# Altium project B905AA.PrjPcb (part 2 of 2)

## Sheet RS485 Under Leaf Sensor Socket.SchDoc: RS485 Under Leaf Sensor Socket
size 292 x 193 mm; SheetNumber: 18; SheetTotal: 21
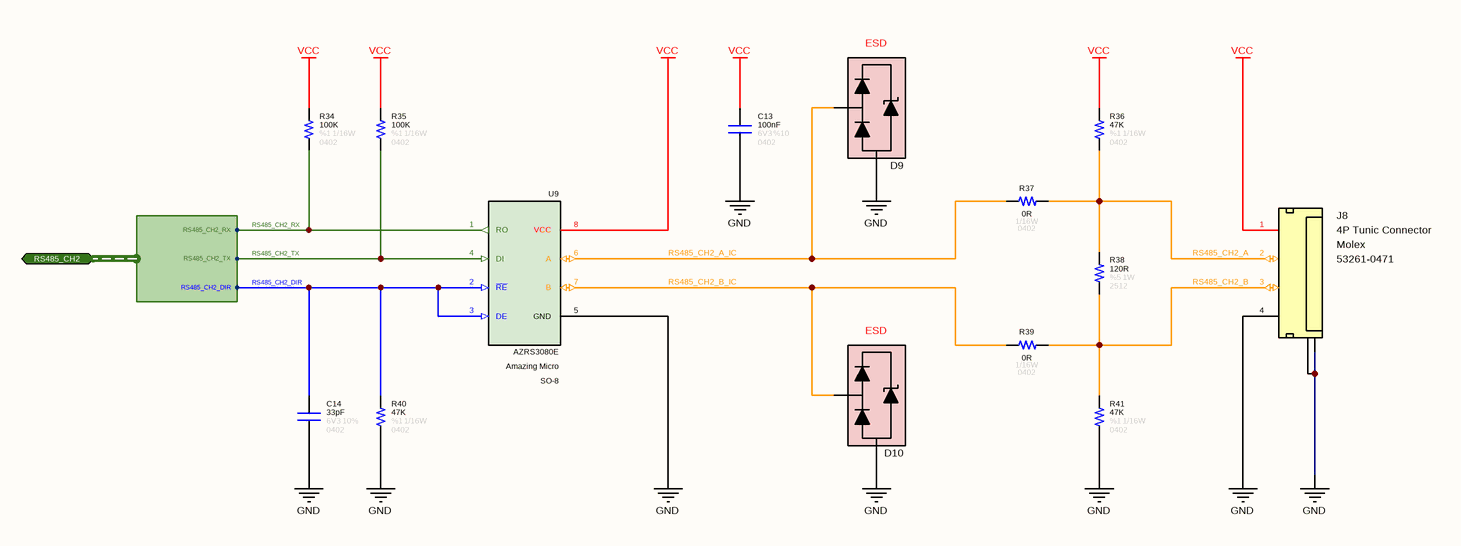
[diagram p15: RS485 Under Leaf Sensor Socket.SchDoc]

### Parts
C13  value 100nF  Tolerance: %10  Voltage: 6V3  Case: 0402  [CAPACITOR_0402]  (hidden comment: Capacitor - 100nF [0402] (Ceramic))
C14  value 33pF  Tolerance: 10%  Case: 0402  Voltage: 6V3  [CAPACITOR_0402]  (hidden comment: Capacitor - 33pF [0402] (Ceramic))
D9  0402ESDA-MLP1  [ESD_0402]  (value not drawn)
D10  0402ESDA-MLP1  [ESD_0402]  (value not drawn)
J8  Manufacturer Name: Molex  Manufacturer Part Number: 53261-0471  [Connector_Tunic 4P]  (hidden comment: 4P SMD Tunic Connector)
R34  value 100K  Tolerance: %1  Case: 0402  Power: 1/16W  [RESISTOR_0402]  (hidden comment: 100K - 0402 - %1 - 1/16W)
R35  value 100K  Tolerance: %1  Case: 0402  Power: 1/16W  [RESISTOR_0402]  (hidden comment: 100K - 0402 - %1 - 1/16W)
R36  value 47K  Tolerance: %1  Case: 0402  Power: 1/16W  [RESISTOR_0402]  (hidden comment: 47K - 0402 - %1 - 1/16W)
R37  value 0R  Case: 0402  Power: 1/16W  [RESISTOR_0402]  (hidden comment: 0R - 0402 - %1 - 1/16W)
R38  value 120R  Tolerance: %5  Case: 2512  Power: 1W  [RESISTOR_2512]  (hidden comment: 120R - 2512 - %5 - 1W)
R39  value 0R  Case: 0402  Power: 1/16W  [RESISTOR_0402]  (hidden comment: 0R - 0402 - %1 - 1/16W)
R40  value 47K  Tolerance: %1  Case: 0402  Power: 1/16W  [RESISTOR_0402]  (hidden comment: 47K - 0402 - %1 - 1/16W)
R41  value 47K  Tolerance: %1  Case: 0402  Power: 1/16W  [RESISTOR_0402]  (hidden comment: 47K - 0402 - %1 - 1/16W)
U9  Case: SO-8  Manufacturer Part Number: AZRS3080E  Manufacturer Name: Amazing Micro  [SOP-8L (AZRS3080E)]  (hidden comment: RS485 Modulator)

### Ports
RS485_CH2 (bidir, harness RS485_CH2)

### Harnesses
RS485_CH2: RS485_CH2_RX, RS485_CH2_TX, RS485_CH2_DIR

### Nets
GND: C13.1 C14.1 D9.2(GND) D10.2(GND) J8.4(Pin-4) J8.5(GND) J8.6(GND) R40.1 R41.1 U9.5(GND)
VCC: C13.2 J8.1(Pin-1) R34.2 R35.2 R36.2 U9.8(VCC)
RS485_CH2_A: J8.2(Pin-2) R36.1 R37.1 R38.2
RS485_CH2_A_IC: D9.1(I/O) R37.2 U9.6(A)
RS485_CH2_B: J8.3(Pin-3) R38.1 R39.1 R41.2
RS485_CH2_B_IC: D10.1(I/O) R39.2 U9.7(B)
RS485_CH2_DIR: C14.2 R40.2 U9.2(~{RE}) U9.3(DE) ; port RS485_CH2.RS485_CH2_DIR
RS485_CH2_RX: R34.1 U9.1(RO) ; port RS485_CH2.RS485_CH2_RX
RS485_CH2_TX: R35.1 U9.4(DI) ; port RS485_CH2.RS485_CH2_TX

### Notes on the sheet
- © 2021 All rights reserved.
  This document may not, in whole or in part, be copied, photocopied, reproduced, translated or converted to any electronic or machine readable from without prior written permission of Mehmet Günce Akkoyun.
  Engineer contact : akkoyun@me.com
- Property of
- Engineer :
- Date :
- Size :
- A4
- Time :
- Project :
- Page :
- /
- Customer :
- Product ID :
- Module ID :
- Version :
- File :
- Revision :
- (in symbol Connector - Mini Tunic 4P (1.25)) 4P Tunic Connector
- (in symbol Diode - TPD1E05U06DPYR) ESD

### Library data of the parts
C13 = Capacitor - 100nF [0402-6V3]: Capacitor - 100nF [0402-6V3] (Ceramic); Manufacturer Name: AVX; Manufacturer Part Number: 04026D104KAT4A; ComponentLink1Description: Mouser; ComponentLink1URL: https://www.mouser.com.tr/ProductDetail/AVX/04026D104KAT4A?qs=sGAEpiMZZMs0AnBnWHyRQPg4iYkCw7IMED%2F4kpqgf7w%3D; ComponentLink2Description: DataSheet; ComponentLink2URL: https://www.mouser.com.tr/datasheet/2/40/cx5r-776519.pdf
C14 = Capacitor - 33pF [0402-6V3]: Manufacturer Name: Kemet; Manufacturer Part Number: C0402C330J9RACAUTO; ComponentLink1Description: DataSheet; ComponentLink1URL: https://api.kemet.com/component-edge/download/datasheet/C0402C330J9RACAUTO.pdf; ComponentLink2Description: Mouser; ComponentLink2URL: https://www.mouser.com/Search/Refine.aspx?Keyword=80-C0402C330J9RAUTO
D9 D10 = Diode - TPD1E05U06DPYR: SUPPRESSOR ESD 30VDC 0402 HFREE; Manufacturer Name: Eaton; Breakdown Voltage: 30V; Capacitance: 0.15pF; Manufacturer Part Number: 0402ESDA-MLP1; Case: 0402
J8 = Connector - Mini Tunic 4P (1.25): Mini Tunic Connector with 4P; Pitch: 1.25mm; Position: 4; ROHS: Yes; ComponentLink1Description: DataSheet; ComponentLink1URL: https://www.mouser.com.tr/datasheet/2/276/0532610471_PCB_HEADERS-170942.pdf; ComponentLink2Description: Mouser; ComponentLink2URL: https://www.mouser.com.tr/ProductDetail/Molex/53261-0471?qs=%2Fha2pyFaduhLhIsk8tywtK7BwWtguBSP4XxyDBTOTfs%3D; Case: SMD
R34 R35 = Resistor - 100K [0402]: Thick Film Resistors - SMD 1/16 W 100 KOhm 1%; Manufacturer Name: Vishay; Manufacturer Part Number: CRCW0402100KFKED; ComponentLink1Description: DataSheet; ComponentLink1URL: https://www.mouser.com.tr/datasheet/2/427/dcrcwe3-1762152.pdf; ComponentLink2Description: Mouser; ComponentLink2URL: https://www.mouser.com.tr/ProductDetail/Vishay-Dale/CRCW040210K0FKED?qs=sGAEpiMZZMu61qfTUdNhG2DpbjADlD3GcalbOv9utCY%3D
R36 R40 R41 = Resistor - 47K [0402]: Thick Film Resistors - SMD 1/16 W 47 KOhm 1%; Manufacturer Name: Vishay; Manufacturer Part Number: CRCW040247K0FKED; ComponentLink1Description: DataSheet; ComponentLink1URL: https://www.mouser.com.tr/datasheet/2/427/dcrcwe3-1762152.pdf; ComponentLink2Description: Mouser; ComponentLink2URL: https://www.mouser.com.tr/ProductDetail/Vishay-Dale/CRCW040247K0FKED?qs=sGAEpiMZZMu61qfTUdNhG2DpbjADlD3GL%252B3h1elTxqU%3D
R37 R39 = Resistor - 0R [0402]: Thick Film Resistors - SMD 1/16 W 0 Ohm; Manufacturer Name: Vishay; Manufacturer Part Number: CRCW04020000Z0ED; ComponentLink1Description: DataSheet; ComponentLink1URL: https://www.mouser.com.tr/datasheet/2/427/dcrcwe3-1762152.pdf; ComponentLink2Description: Mouser; ComponentLink2URL: https://www.mouser.com.tr/ProductDetail/Vishay-Dale/CRCW04020000Z0ED?qs=sGAEpiMZZMu61qfTUdNhG2DpbjADlD3GG34cJb50zyg%3D
R38 = Resistor - 120R [2512]: Thick Film Resistors - SMD 1 W 120 Ohm 5%; Manufacturer Name: YAGEO; Manufacturer Part Number: RC2512JK-07120RL; ComponentLink1Description: DataSheet; ComponentLink1URL: https://www.mouser.com.tr/datasheet/2/447/PYu_RC_Group_51_RoHS_L_11-1984063.pdf
U9 = IC - AZRS3080E: Half-duplex RS485 transceiver.; RoHS: Yes; ComponentLink1Description: DataSheet; ComponentLink1URL: https://www.amazingic.com/common/frontend/download?path=/uploads/images/products/PDF/AZRS/AZRS3080E.pdf

## Sheet RS485 Reserved Sensor Socket.SchDoc: RS485 Reserved Sensor Socket
size 292 x 193 mm; SheetNumber: 19; SheetTotal: 21
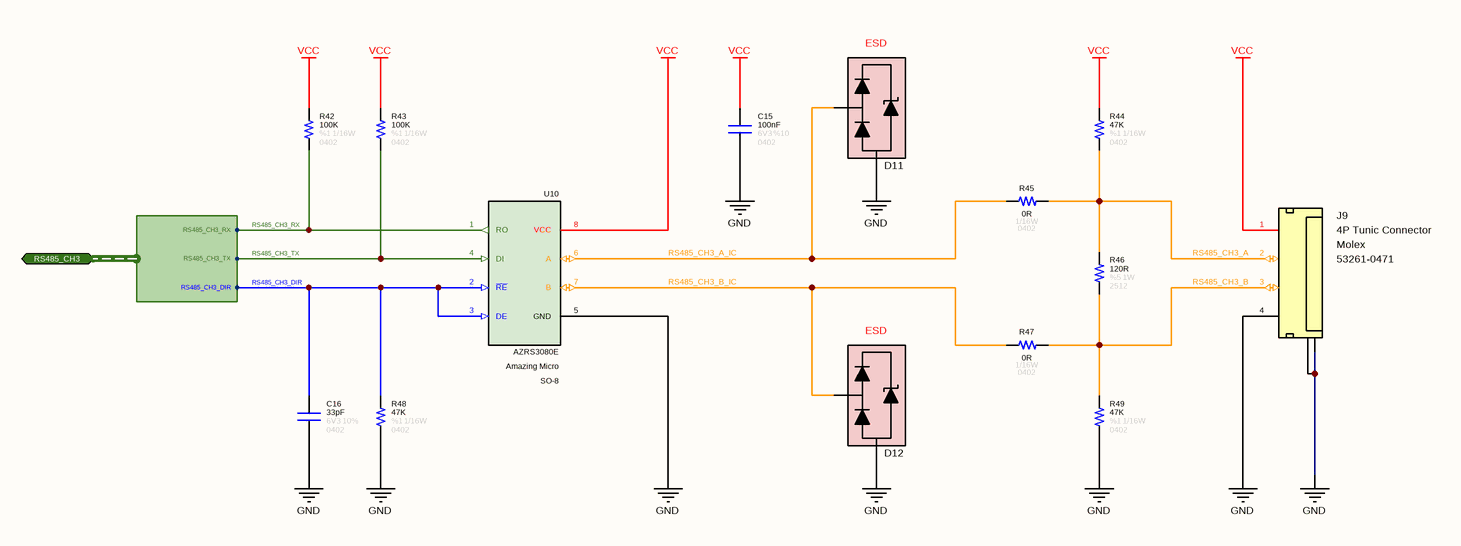
[diagram p16: RS485 Reserved Sensor Socket.SchDoc]

### Parts
C15  value 100nF  Tolerance: %10  Voltage: 6V3  Case: 0402  [CAPACITOR_0402]  (hidden comment: Capacitor - 100nF [0402] (Ceramic))
C16  value 33pF  Tolerance: 10%  Case: 0402  Voltage: 6V3  [CAPACITOR_0402]  (hidden comment: Capacitor - 33pF [0402] (Ceramic))
D11  0402ESDA-MLP1  [ESD_0402]  (value not drawn)
D12  0402ESDA-MLP1  [ESD_0402]  (value not drawn)
J9  Manufacturer Name: Molex  Manufacturer Part Number: 53261-0471  [Connector_Tunic 4P]  (hidden comment: 4P SMD Tunic Connector)
R42  value 100K  Tolerance: %1  Case: 0402  Power: 1/16W  [RESISTOR_0402]  (hidden comment: 100K - 0402 - %1 - 1/16W)
R43  value 100K  Tolerance: %1  Case: 0402  Power: 1/16W  [RESISTOR_0402]  (hidden comment: 100K - 0402 - %1 - 1/16W)
R44  value 47K  Tolerance: %1  Case: 0402  Power: 1/16W  [RESISTOR_0402]  (hidden comment: 47K - 0402 - %1 - 1/16W)
R45  value 0R  Case: 0402  Power: 1/16W  [RESISTOR_0402]  (hidden comment: 0R - 0402 - %1 - 1/16W)
R46  value 120R  Tolerance: %5  Case: 2512  Power: 1W  [RESISTOR_2512]  (hidden comment: 120R - 2512 - %5 - 1W)
R47  value 0R  Case: 0402  Power: 1/16W  [RESISTOR_0402]  (hidden comment: 0R - 0402 - %1 - 1/16W)
R48  value 47K  Tolerance: %1  Case: 0402  Power: 1/16W  [RESISTOR_0402]  (hidden comment: 47K - 0402 - %1 - 1/16W)
R49  value 47K  Tolerance: %1  Case: 0402  Power: 1/16W  [RESISTOR_0402]  (hidden comment: 47K - 0402 - %1 - 1/16W)
U10  Case: SO-8  Manufacturer Part Number: AZRS3080E  Manufacturer Name: Amazing Micro  [SOP-8L (AZRS3080E)]  (hidden comment: RS485 Modulator)

### Ports
RS485_CH3 (bidir, harness RS485_CH3)

### Harnesses
RS485_CH3: RS485_CH3_RX, RS485_CH3_TX, RS485_CH3_DIR

### Nets
GND: C15.1 C16.1 D11.2(GND) D12.2(GND) J9.4(Pin-4) J9.5(GND) J9.6(GND) R48.1 R49.1 U10.5(GND)
VCC: C15.2 J9.1(Pin-1) R42.2 R43.2 R44.2 U10.8(VCC)
RS485_CH3_A: J9.2(Pin-2) R44.1 R45.1 R46.2
RS485_CH3_A_IC: D11.1(I/O) R45.2 U10.6(A)
RS485_CH3_B: J9.3(Pin-3) R46.1 R47.1 R49.2
RS485_CH3_B_IC: D12.1(I/O) R47.2 U10.7(B)
RS485_CH3_DIR: C16.2 R48.2 U10.2(~{RE}) U10.3(DE) ; port RS485_CH3.RS485_CH3_DIR
RS485_CH3_RX: R42.1 U10.1(RO) ; port RS485_CH3.RS485_CH3_RX
RS485_CH3_TX: R43.1 U10.4(DI) ; port RS485_CH3.RS485_CH3_TX

### Notes on the sheet
- © 2021 All rights reserved.
  This document may not, in whole or in part, be copied, photocopied, reproduced, translated or converted to any electronic or machine readable from without prior written permission of Mehmet Günce Akkoyun.
  Engineer contact : akkoyun@me.com
- Property of
- Engineer :
- Date :
- Size :
- A4
- Time :
- Project :
- Page :
- /
- Customer :
- Product ID :
- Module ID :
- Version :
- File :
- Revision :
- (in symbol Connector - Mini Tunic 4P (1.25)) 4P Tunic Connector
- (in symbol Diode - TPD1E05U06DPYR) ESD

### Library data of the parts
C15 = Capacitor - 100nF [0402-6V3]: as C13 on sheet RS485 Under Leaf Sensor Socket; ComponentLink1Description: Mouser; ComponentLink1URL: https://www.mouser.com.tr/ProductDetail/AVX/04026D104KAT4A?qs=sGAEpiMZZMs0AnBnWHyRQPg4iYkCw7IMED%2F4kpqgf7w%3D; ComponentLink2Description: DataSheet; ComponentLink2URL: https://www.mouser.com.tr/datasheet/2/40/cx5r-776519.pdf
C16 = Capacitor - 33pF [0402-6V3]: as C14 on sheet RS485 Under Leaf Sensor Socket; ComponentLink1Description: DataSheet; ComponentLink1URL: https://api.kemet.com/component-edge/download/datasheet/C0402C330J9RACAUTO.pdf; ComponentLink2Description: Mouser; ComponentLink2URL: https://www.mouser.com/Search/Refine.aspx?Keyword=80-C0402C330J9RAUTO
D11 D12 = Diode - TPD1E05U06DPYR: as D9 on sheet RS485 Under Leaf Sensor Socket; Manufacturer Part Number: 0402ESDA-MLP1; Case: 0402
J9 = Connector - Mini Tunic 4P (1.25): as J8 on sheet RS485 Under Leaf Sensor Socket; ROHS: Yes; ComponentLink1Description: DataSheet; ComponentLink1URL: https://www.mouser.com.tr/datasheet/2/276/0532610471_PCB_HEADERS-170942.pdf; ComponentLink2Description: Mouser; ComponentLink2URL: https://www.mouser.com.tr/ProductDetail/Molex/53261-0471?qs=%2Fha2pyFaduhLhIsk8tywtK7BwWtguBSP4XxyDBTOTfs%3D; Case: SMD
R42 R43 = Resistor - 100K [0402]: as R34 on sheet RS485 Under Leaf Sensor Socket; ComponentLink1Description: DataSheet; ComponentLink1URL: https://www.mouser.com.tr/datasheet/2/427/dcrcwe3-1762152.pdf; ComponentLink2Description: Mouser; ComponentLink2URL: https://www.mouser.com.tr/ProductDetail/Vishay-Dale/CRCW040210K0FKED?qs=sGAEpiMZZMu61qfTUdNhG2DpbjADlD3GcalbOv9utCY%3D
R44 R48 R49 = Resistor - 47K [0402]: as R36 on sheet RS485 Under Leaf Sensor Socket; ComponentLink1Description: DataSheet; ComponentLink1URL: https://www.mouser.com.tr/datasheet/2/427/dcrcwe3-1762152.pdf; ComponentLink2Description: Mouser; ComponentLink2URL: https://www.mouser.com.tr/ProductDetail/Vishay-Dale/CRCW040247K0FKED?qs=sGAEpiMZZMu61qfTUdNhG2DpbjADlD3GL%252B3h1elTxqU%3D
R45 R47 = Resistor - 0R [0402]: as R37 on sheet RS485 Under Leaf Sensor Socket; ComponentLink1Description: DataSheet; ComponentLink1URL: https://www.mouser.com.tr/datasheet/2/427/dcrcwe3-1762152.pdf; ComponentLink2Description: Mouser; ComponentLink2URL: https://www.mouser.com.tr/ProductDetail/Vishay-Dale/CRCW04020000Z0ED?qs=sGAEpiMZZMu61qfTUdNhG2DpbjADlD3GG34cJb50zyg%3D
R46 = Resistor - 120R [2512]: as R38 on sheet RS485 Under Leaf Sensor Socket; ComponentLink1Description: DataSheet; ComponentLink1URL: https://www.mouser.com.tr/datasheet/2/447/PYu_RC_Group_51_RoHS_L_11-1984063.pdf
U10 = IC - AZRS3080E: Half-duplex RS485 transceiver.; RoHS: Yes; ComponentLink1Description: DataSheet; ComponentLink1URL: https://www.amazingic.com/common/frontend/download?path=/uploads/images/products/PDF/AZRS/AZRS3080E.pdf

## Sheet B802 PCIe Socket.SchDoc: B802AA PCIe Socket
size 292 x 193 mm; SheetNumber: 18; SheetTotal: 18
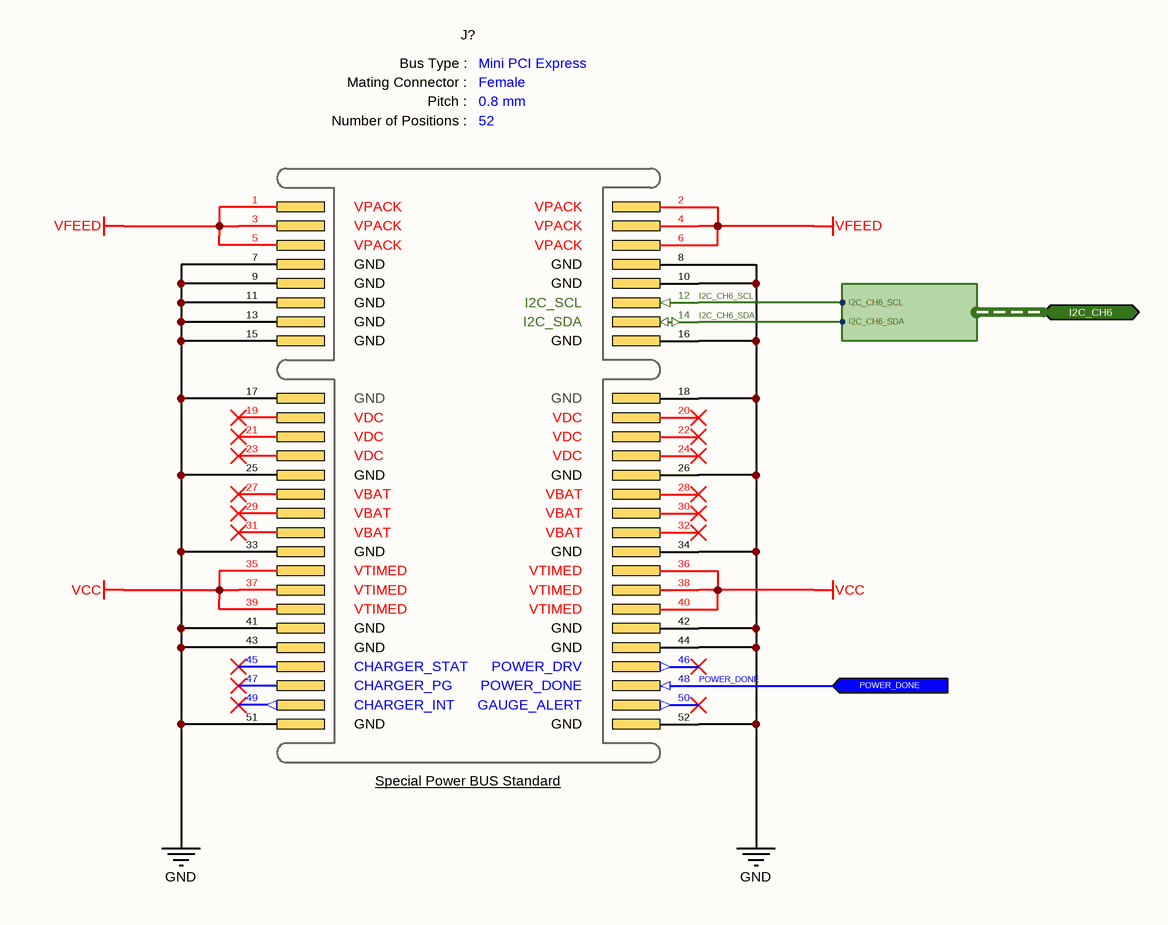
[diagram p17: B802 PCIe Socket.SchDoc]

### Parts
J?  BUS Type: Mini PCI Express  Connector Type: Female  Pitch: 0.8 mm  Number of Positions: 52  [CONNECTOR - Mini PCIe (Light)]  (hidden comment: TE-1775862-2)

### Ports
I2C_CH6 (bidir, harness I2C_CH6), POWER_DONE (in)

### Harnesses
I2C_CH6: I2C_CH6_SCL, I2C_CH6_SDA

### Nets
GND: J?.7(Pin-7) J?.8(Pin-8) J?.9(Pin-9) J?.10(Pin-10) J?.11(Pin-11) J?.13(Pin-13) J?.15(Pin-15) J?.16(Pin-16) J?.17(Pin-17) J?.18(Pin-18) J?.25(Pin-25) J?.26(Pin-26) J?.33(Pin-33) J?.34(Pin-34) J?.41(Pin-41) J?.42(Pin-42) J?.43(Pin-43) J?.44(Pin-44) J?.51(Pin-51) J?.52(Pin-52)
VCC: J?.35(Pin-35) J?.36(Pin-36) J?.37(Pin-37) J?.38(Pin-38) J?.39(Pin-39) J?.40(Pin-40)
VFEED: J?.1(Pin-1) J?.2(Pin-2) J?.3(Pin-3) J?.4(Pin-4) J?.5(Pin-5) J?.6(Pin-6)
I2C_CH6_SCL: J?.12(Pin-12) ; port I2C_CH6.I2C_CH6_SCL
I2C_CH6_SDA: J?.14(Pin-14) ; port I2C_CH6.I2C_CH6_SDA
POWER_DONE: J?.48(Pin-48) ; port POWER_DONE

Not connected (* = marked no-connect by the designer): J? 19(Pin-19)* 20(Pin-20)* 21(Pin-21)* 22(Pin-22)* 23(Pin-23)* 24(Pin-24)* 27(Pin-27)* 28(Pin-28)* 29(Pin-29)* 30(Pin-30)* 31(Pin-31)* 32(Pin-32)* 45(Pin-45)* 46(Pin-46)* 47(Pin-47)* 49(Pin-49)* 50(Pin-50)*

### Notes on the sheet
- © 2021 All rights reserved.
  This document may not, in whole or in part, be copied, photocopied, reproduced, translated or converted to any electronic or machine readable from without prior written permission of Mehmet Günce Akkoyun.
  Engineer contact : akkoyun@me.com
- Property of
- Engineer :
- Date :
- Size :
- A4
- Time :
- Project :
- Page :
- /
- Customer :
- Product ID :
- Module ID :
- Version :
- File :
- Revision :
- (in symbol Connector - Mini PCI-E (Female B802)) Bus Type :; Mating Connector :; Pitch :; Number of Positions :; VPACK; GND; I2C_SCL; I2C_SDA; VDC; VBAT; VTIMED; CHARGER_STAT; POWER_DRV; CHARGER_PG; POWER_DONE; CHARGER_INT; GAUGE_ALERT; Special Power BUS Standard

### Library data of the parts
J? = Connector - Mini PCI-E (Female B802): Mini PCI-Express female connector.; Manufacturer Name: TE Connectivity; Manufacturer Part Number: TE-1775862-2; System: Connector

## Nets that join several sheets
GND: B001 PCIe Socket (J1.15 J1.16 J1.45 J1.51), B101 PCIe Socket (12 pins), I2C Multiplexer (6 pins), I2C DP Sensor 1 (C3.1 U2.3), I2C DP Sensor 2 (C4.1 U3.3), I2C DP Sensor 3 (C5.1 U4.3), I2C TH Sensor Socket (5 pins), I2C UV Sensor (C32.1 U15.8), I2C P Sensor (C6.1 C7.1 U5.3), RS485 Multiplexer (C8.1 U6.7 U6.8), RS485 Rain Sensor Socket (10 pins), RS485 Soil Temperature Sensor Socket (10 pins), RS485 Under Leaf Sensor Socket (10 pins), RS485 Reserved Sensor Socket (10 pins), B802 PCIe Socket (20 pins)
VCC: B001 PCIe Socket (9 pins), I2C Multiplexer (6 pins), I2C DP Sensor 1 (C3.2 R6.2 R7.2 U2.2), I2C DP Sensor 2 (C4.2 R8.2 R9.2 U3.2), I2C DP Sensor 3 (C5.2 R10.2 R11.2 U4.2), I2C TH Sensor Socket (J4.1 R14.2 R15.2), I2C UV Sensor (6 pins), I2C P Sensor (5 pins), RS485 Multiplexer (C8.2 U6.16), RS485 Rain Sensor Socket (6 pins), RS485 Soil Temperature Sensor Socket (6 pins), RS485 Under Leaf Sensor Socket (6 pins), RS485 Reserved Sensor Socket (6 pins), B802 PCIe Socket (6 pins)
VFEED: B101 PCIe Socket (6 pins), B802 PCIe Socket (6 pins)
GNSS_EN: B001 PCIe Socket (J1.30), B101 PCIe Socket (J2.36)
GSM_COMMEN: B001 PCIe Socket (J1.52), B101 PCIe Socket (J2.14)
GSM_ON/OFF: B001 PCIe Socket (J1.42), B101 PCIe Socket (J2.32)
GSM_PWR_EN: B001 PCIe Socket (J1.32), B101 PCIe Socket (J2.12)
GSM_PWRMON: B001 PCIe Socket (J1.46), B101 PCIe Socket (J2.26)
GSM_RING: B001 PCIe Socket (J1.50), B101 PCIe Socket (J2.30)
GSM_RX: B001 PCIe Socket (J1.40), B101 PCIe Socket (J2.20)
GSM_SDOWN: B001 PCIe Socket (J1.44), B101 PCIe Socket (J2.34)
GSM_SWREADY: B001 PCIe Socket (J1.48), B101 PCIe Socket (J2.28)
GSM_TX: B001 PCIe Socket (J1.38), B101 PCIe Socket (J2.22)
I2C_CH0_SCL: I2C Multiplexer (U1.5), I2C DP Sensor 1 (R6.1 U2.1)
I2C_CH0_SDA: I2C Multiplexer (U1.4), I2C DP Sensor 1 (R7.1 U2.4)
I2C_CH1_SCL: I2C Multiplexer (U1.7), I2C DP Sensor 2 (R8.1 U3.1)
I2C_CH1_SDA: I2C Multiplexer (U1.6), I2C DP Sensor 2 (R9.1 U3.4)
I2C_CH2_SCL: I2C Multiplexer (U1.9), I2C DP Sensor 3 (R10.1 U4.1)
I2C_CH2_SDA: I2C Multiplexer (U1.8), I2C DP Sensor 3 (R11.1 U4.4)
I2C_CH3_SCL: I2C Multiplexer (U1.11), I2C P Sensor (R12.1 U5.8)
I2C_CH3_SDA: I2C Multiplexer (U1.10), I2C P Sensor (R13.1 U5.7)
I2C_CH4_SCL: I2C Multiplexer (U1.14), I2C TH Sensor Socket (D1.1 J4.2 R14.1)
I2C_CH4_SDA: I2C Multiplexer (U1.13), I2C TH Sensor Socket (D2.1 J4.3 R15.1)
I2C_CH5_SCL: I2C Multiplexer (U1.16), I2C UV Sensor (R16.1 U15.2)
I2C_CH5_SDA: I2C Multiplexer (U1.15), I2C UV Sensor (R17.1 U15.1)
I2C_CH6_SCL: I2C Multiplexer (U1.18), B802 PCIe Socket (J?.12)
I2C_CH6_SDA: I2C Multiplexer (U1.17), B802 PCIe Socket (J?.14)
I2C_SCL: B001 PCIe Socket (J1.34), I2C Multiplexer (U1.22)
I2C_SDA: B001 PCIe Socket (J1.36), I2C Multiplexer (U1.23)
POWER_DONE: B001 PCIe Socket (J1.28), B802 PCIe Socket (J?.48)
RS485_CH0_DIR: B001 PCIe Socket (J1.27), RS485 Rain Sensor Socket (C10.2 R24.2 U7.2 U7.3)
RS485_CH0_RX: RS485 Multiplexer (U6.1), RS485 Rain Sensor Socket (R18.1 U7.1)
RS485_CH0_TX: RS485 Multiplexer (U6.12), RS485 Rain Sensor Socket (R19.1 U7.4)
RS485_CH1_DIR: B001 PCIe Socket (J1.25), RS485 Soil Temperature Sensor Socket (C12.2 R32.2 U8.2 U8.3)
RS485_CH1_RX: RS485 Multiplexer (U6.5), RS485 Soil Temperature Sensor Socket (R26.1 U8.1)
RS485_CH1_TX: RS485 Multiplexer (U6.14), RS485 Soil Temperature Sensor Socket (R27.1 U8.4)
RS485_CH2_DIR: B001 PCIe Socket (J1.29), RS485 Under Leaf Sensor Socket (C14.2 R40.2 U9.2 U9.3)
RS485_CH2_RX: RS485 Multiplexer (U6.2), RS485 Under Leaf Sensor Socket (R34.1 U9.1)
RS485_CH2_TX: RS485 Multiplexer (U6.15), RS485 Under Leaf Sensor Socket (R35.1 U9.4)
RS485_CH3_DIR: B001 PCIe Socket (J1.23), RS485 Reserved Sensor Socket (C16.2 R48.2 U10.2 U10.3)
RS485_CH3_RX: RS485 Multiplexer (U6.4), RS485 Reserved Sensor Socket (R42.1 U10.1)
RS485_CH3_TX: RS485 Multiplexer (U6.11), RS485 Reserved Sensor Socket (R43.1 U10.4)
RS485_DIR_A: B001 PCIe Socket (J1.19), RS485 Multiplexer (U6.10)
RS485_DIR_B: B001 PCIe Socket (J1.21), RS485 Multiplexer (U6.9)
RS485_EN: B001 PCIe Socket (J1.17), RS485 Multiplexer (U6.6)
RS485_RX: B001 PCIe Socket (J1.33), RS485 Multiplexer (U6.3)
RS485_TX: B001 PCIe Socket (J1.35), RS485 Multiplexer (U6.13)